# Altium schematic sheet Part1.SchDoc
size A
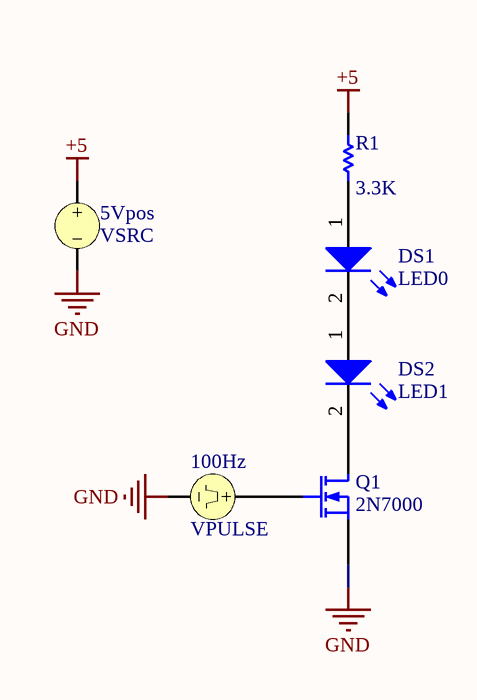
[diagram p0: Part1.SchDoc]

## Parts
5Vpos  VSRC
100Hz  VPULSE
DS1  LED0  [LED-0]
DS2  LED1  [LED-1]
Q1  2N7000  [BCY-W3/D5]
R1  3.3k  [AXIAL-0.3]

## Nets
+5: 5Vpos.1 R1.2
GND: 5Vpos.2 100Hz.2 Q1.1(S)
Net100Hz_1: 100Hz.1 Q1.2(G)
NetDS1_1: DS1.1(A) R1.1
NetDS1_2: DS1.2(K) DS2.1(A)
NetDS2_2: DS2.2(K) Q1.3(D)

## Library data of the parts
5Vpos = VSRC: Voltage Source; Note: PCB Footprint - Not required; Value: +5; Published: 8-Jun-2000; LatestRevisionDate: 17-Jul-2002; LatestRevisionNote: Re-released for DXP Platform.; PackageReference: Not Applicable; Publisher: Altium Limited
100Hz = VPULSE: Pulse Voltage Source; Note: PCB Footprint - Not required; Published: 8-Jun-2000; LatestRevisionDate: 15-Nov-2004; LatestRevisionNote: Corrected Netlist.; PackageReference: Not Applicable; Publisher: Altium Limited
DS1 = LED0: Typical INFRARED GaAs LED; Manufacturer: Generic Components; Class: Optoelectronic; Published: 08/06/2000; Publisher: Altium Hobart Technology Centre; SubClass: LED
DS2 = LED1: Typical RED GaAs LED; Manufacturer: Generic Components; Class: Optoelectronic; Published: 08/06/2000; Publisher: Altium Hobart Technology Centre; SubClass: LED
Q1 = 2N7000: N-Channel Enhancement Mode Vertical DMOS FET; Manufacturer: Zetex; Class: Discrete; SubClass: MOSFET - Low Power; Published: 8/06/2000; Publisher: Altium Hobart Technology Centre
R1 = Res1: Resistor; Manufacturer: Generic Components; Class: Passive; Published: 08/06/2000; Publisher: Altium Hobart Technology Centre; SubClass: Resistor; Value: 3.3K